# EAGLE schematic temp_control (EAGLE 6.2)
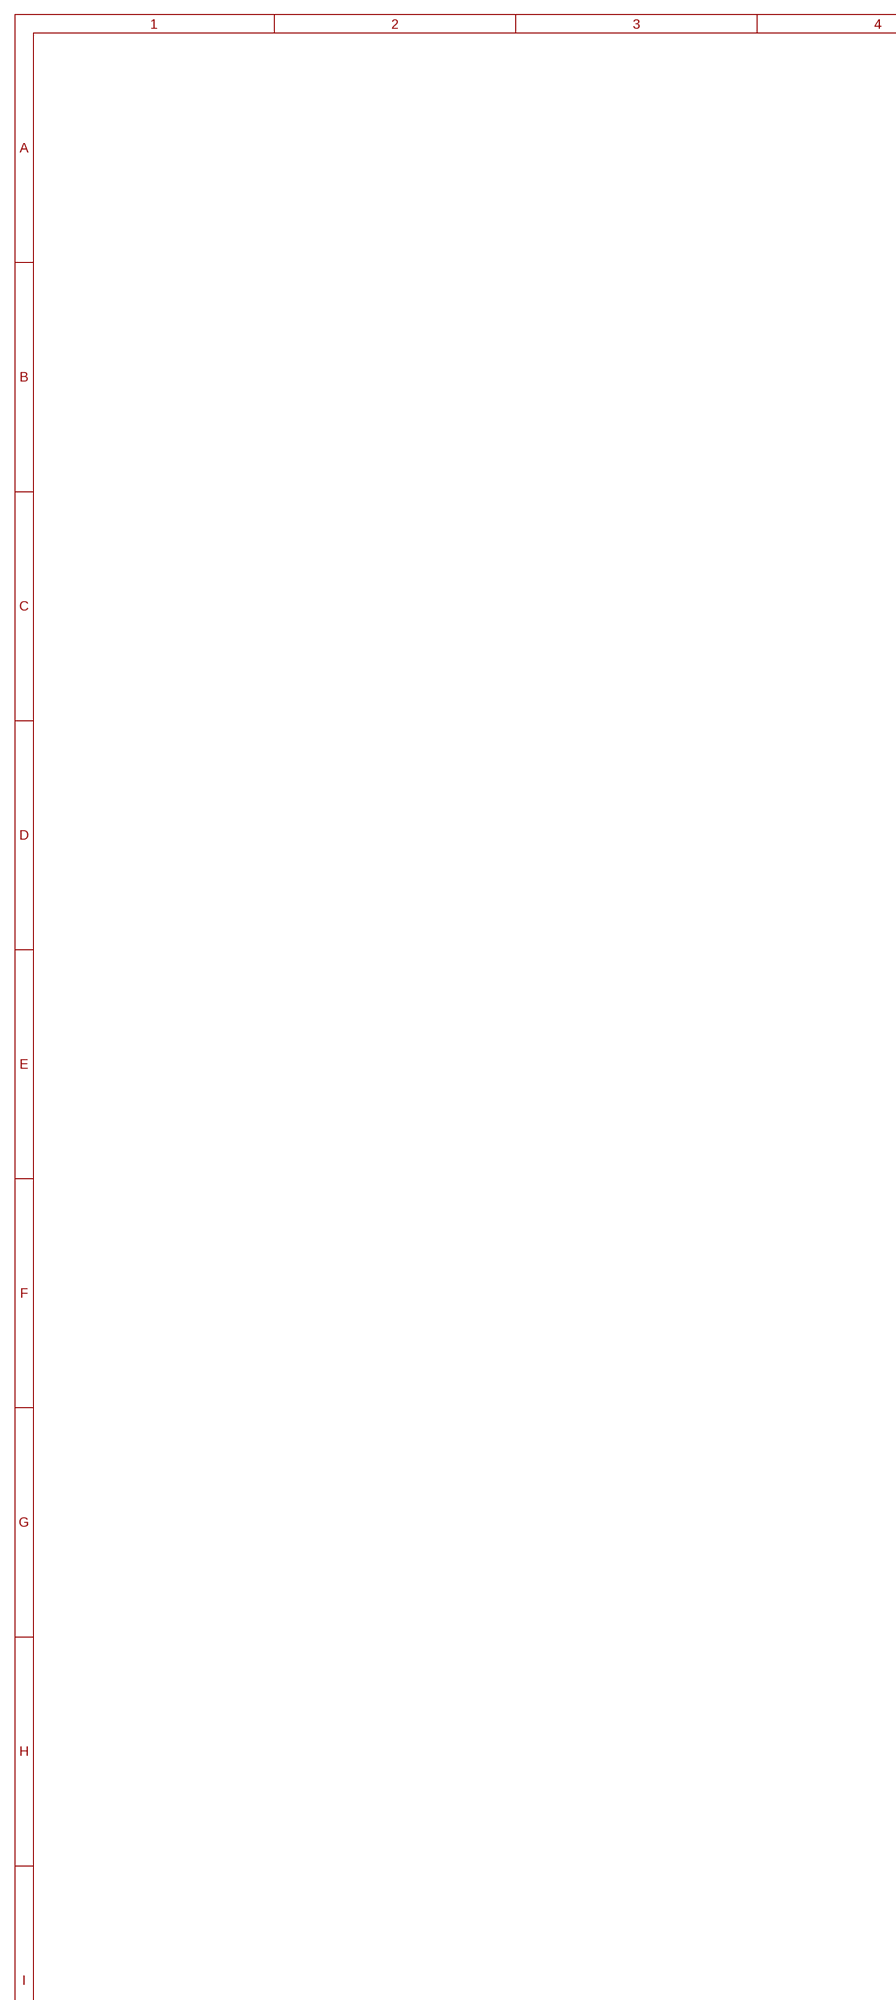
[diagram p0: schematic, sheet 1, part 1 of 2]
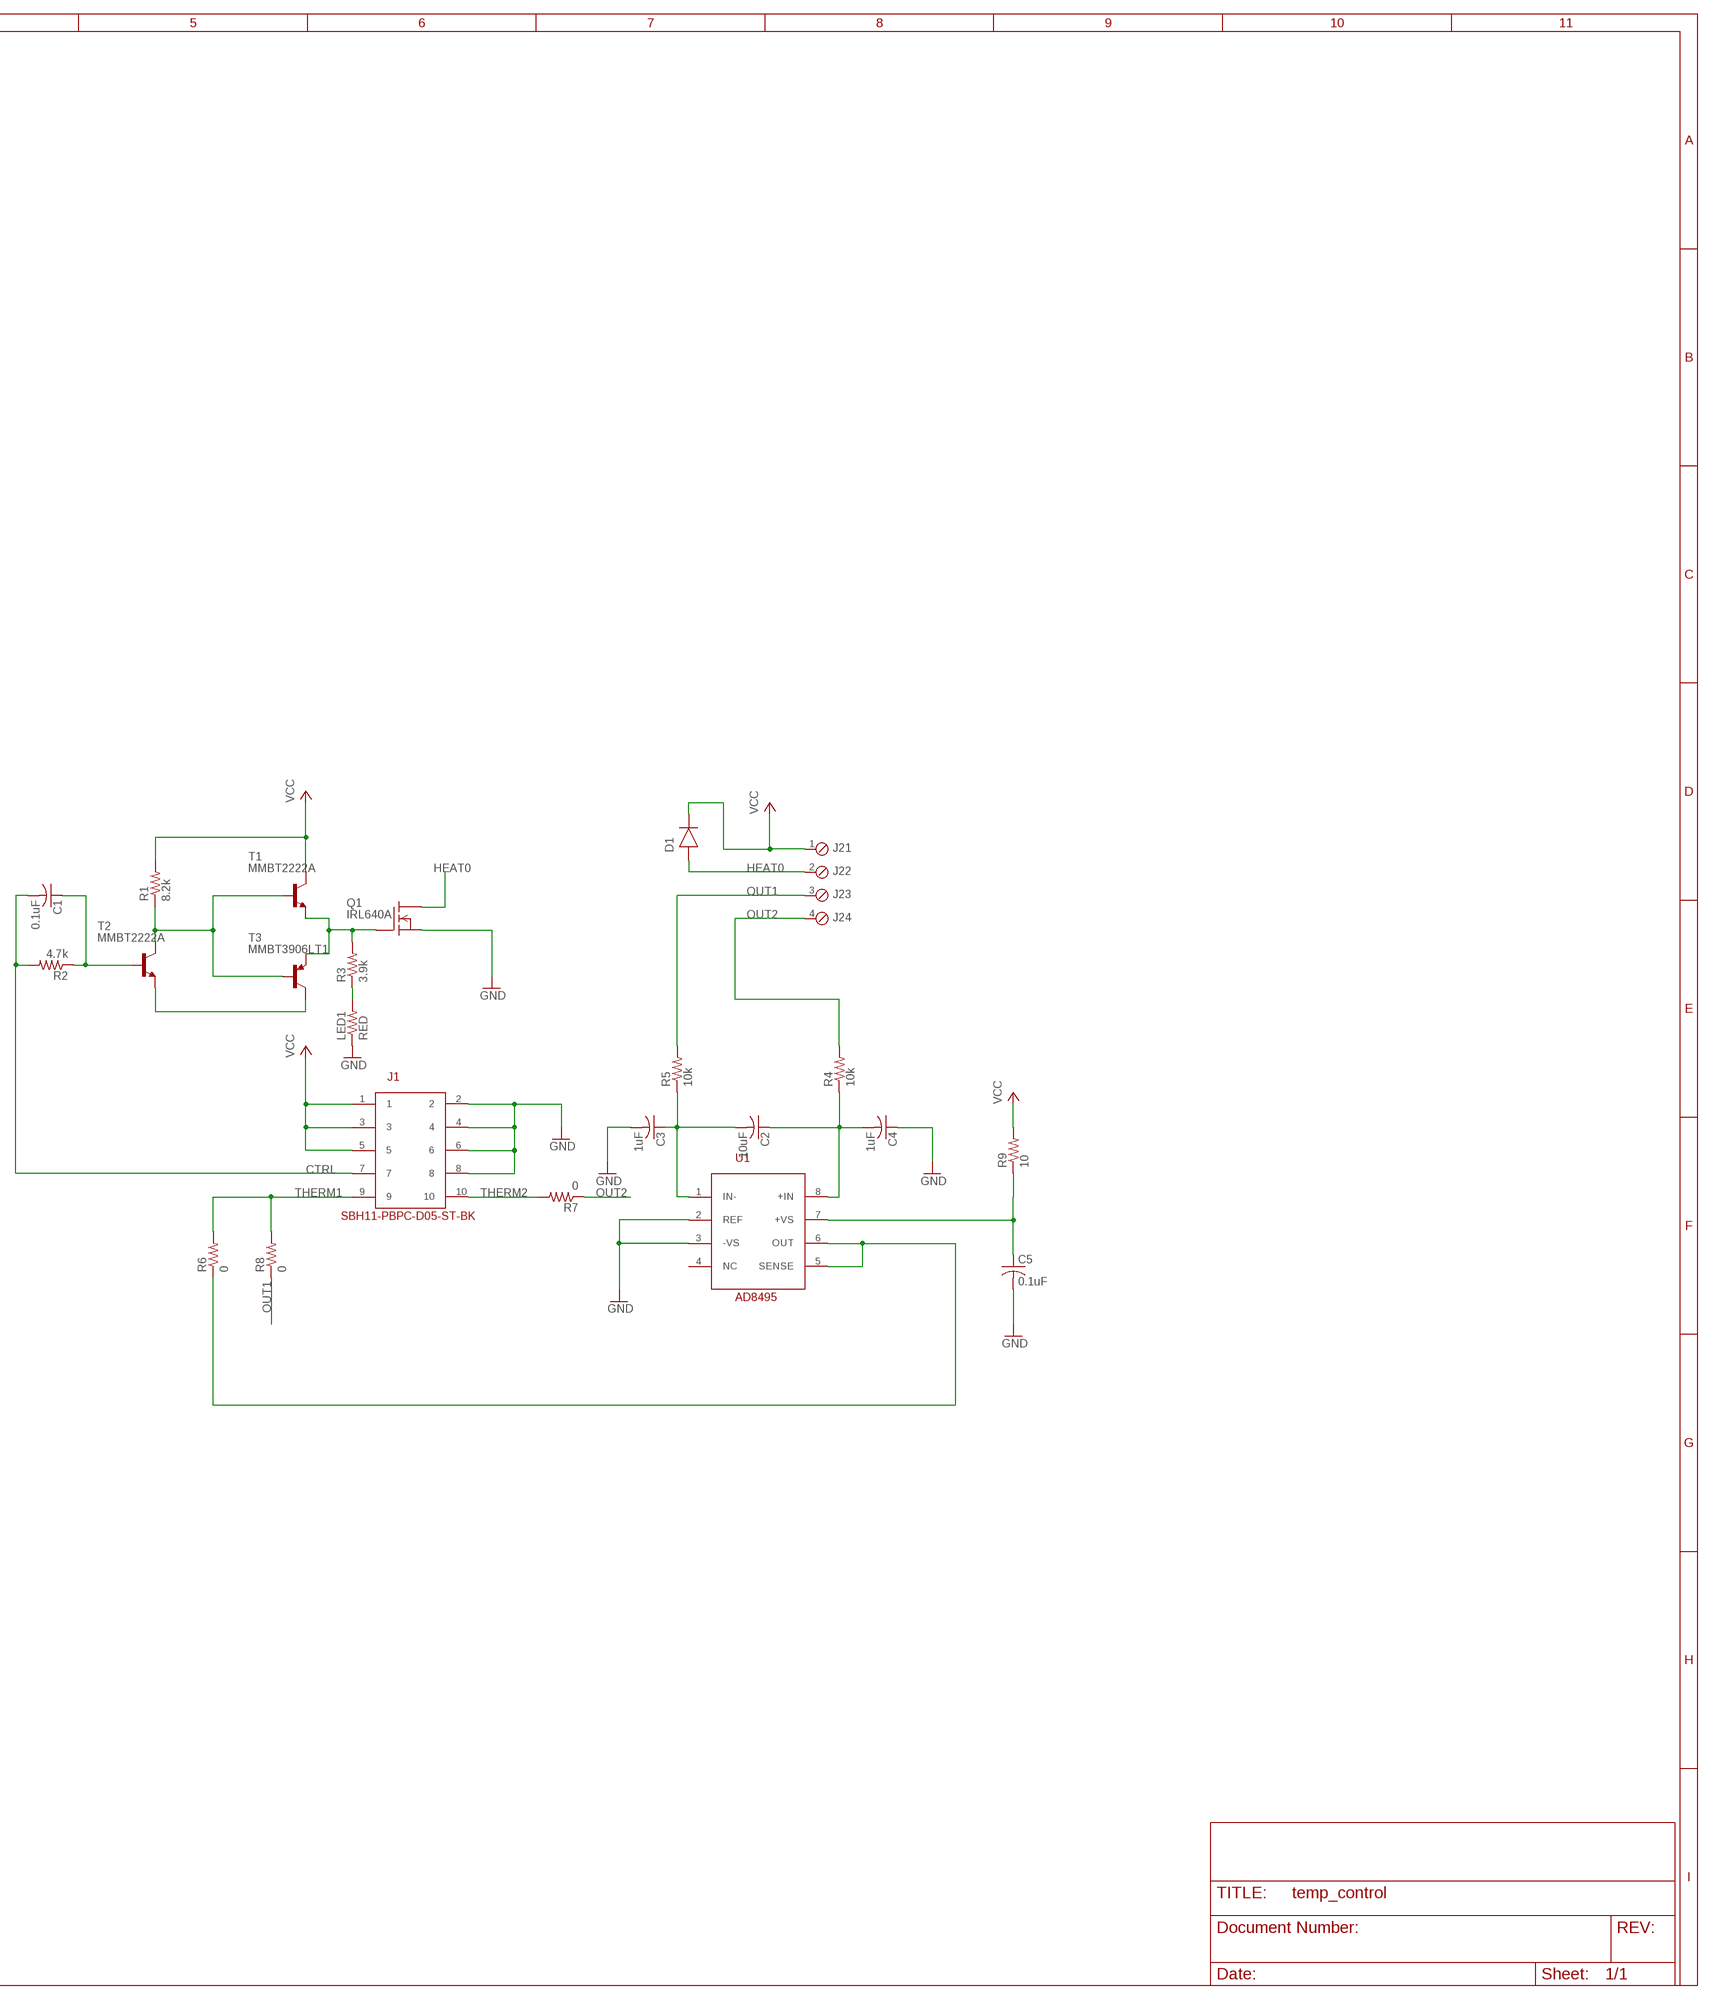
[diagram p1: schematic, sheet 1, part 2 of 2]

## Parts
C1  0.1uF  C-USC0603  [C0603]
C2  10uF  C-USC0603  [C0603]
C3  1uF  C-USC0603  [C0603]
C4  1uF  C-USC0603  [C0603]
C5  0.1uF  C-USC0603  [C0603]
D1  B340A-13-F  DISCRETE_DIODESMA  [DISCRETE_SMA]
J1  SBH11-PBPC-D05-ST-BK  [SBH11-PBPC-D05-ST-BK]
J2  OSTVN04A150  [4POL254]
LED1  RED  R-US_R0603  [R0603]
Q1  IRL640A  SUP75N06-08  [TO220]
R1  8.2k  R-US_R0603  [R0603]
R2  4.7k  R-US_R0603  [R0603]
R3  3.9k  R-US_R0603  [R0603]
R4  10k  R-US_R0603  [R0603]
R5  10k  R-US_R0603  [R0603]
R6  0  R-US_R0603  [R0603]
R7  0  R-US_R0603  [R0603]
R8  0  R-US_R0603  [R0603]
R9  10  R-US_R0603  [R0603]
T1  MMBT2222A  MMBT2222ALT1-NPN-SOT23-BEC  [SOT23-BEC]
T2  MMBT2222A  MMBT2222ALT1-NPN-SOT23-BEC  [SOT23-BEC]
T3  MMBT3906LT1  MMBT3906LT1-PNP-SOT23-BEC  [SOT23-BEC]
U1  AD8495  [MSOP08]

## Nets
CTRL: C1.2 J1.7 R2.2
GND: C3.2 C4.1 C5.2 J1.2 J1.4 J1.6 J1.8 LED1.1 Q1.3(S) U1.2(REF) U1.3(-VS)
HEAT0: D1.A J2.2 Q1.2(D)
N$1: LED1.2 R3.1
N$2: C2.2 C3.1 R5.1 U1.1(IN-)
N$3: C1.1 R2.1 T2.B
N$4: R1.1 T1.B T2.C T3.B
N$5: C2.1 C4.2 R4.1 U1.8(+IN)
N$6: Q1.1(G) R3.2 T1.E T3.E
N$7: C5.1 R9.1 U1.7(+VS)
N$8: T2.E T3.C
N$12: R6.1 U1.5(SENSE) U1.6(OUT)
OUT1: J2.3 R5.2 R8.1
OUT2: J2.4 R4.2 R7.1
THERM1: J1.9 R6.2 R8.2
THERM2: J1.10 R7.2
VCC: D1.C J1.1 J1.3 J1.5 J2.1 R1.2 R9.2 T1.C
Unconnected: U1.4(NC)

## Library data of the parts
C1-C5 = resistor:C-US: CAPACITOR, American symbol
D1 = chipKIT_Max32:DISCRETE_DIODE: Diode
J1 = SBH11-PBPC-D05-ST-BK:SBH11-PBPC-D05-ST-BK
J2 = con-OST-254:OSTVN04A150
LED1 R1-R9 = resistor:R-US_: RESISTOR, American symbol
Q1 = transistor-fet:SUP75N06-08: N-Channel Enhancement MOSFET 60V; 75A; 0,008Ohm
T1 T2 = transistor:*-NPN-: NPN Transistror BF959 corrected 2008.03.06
T3 = transistor:*-PNP-: PNP Transistror
U1 = analog-devices:AD8495